# EAGLE design schema_v4_4 (EAGLE 6.5.0)
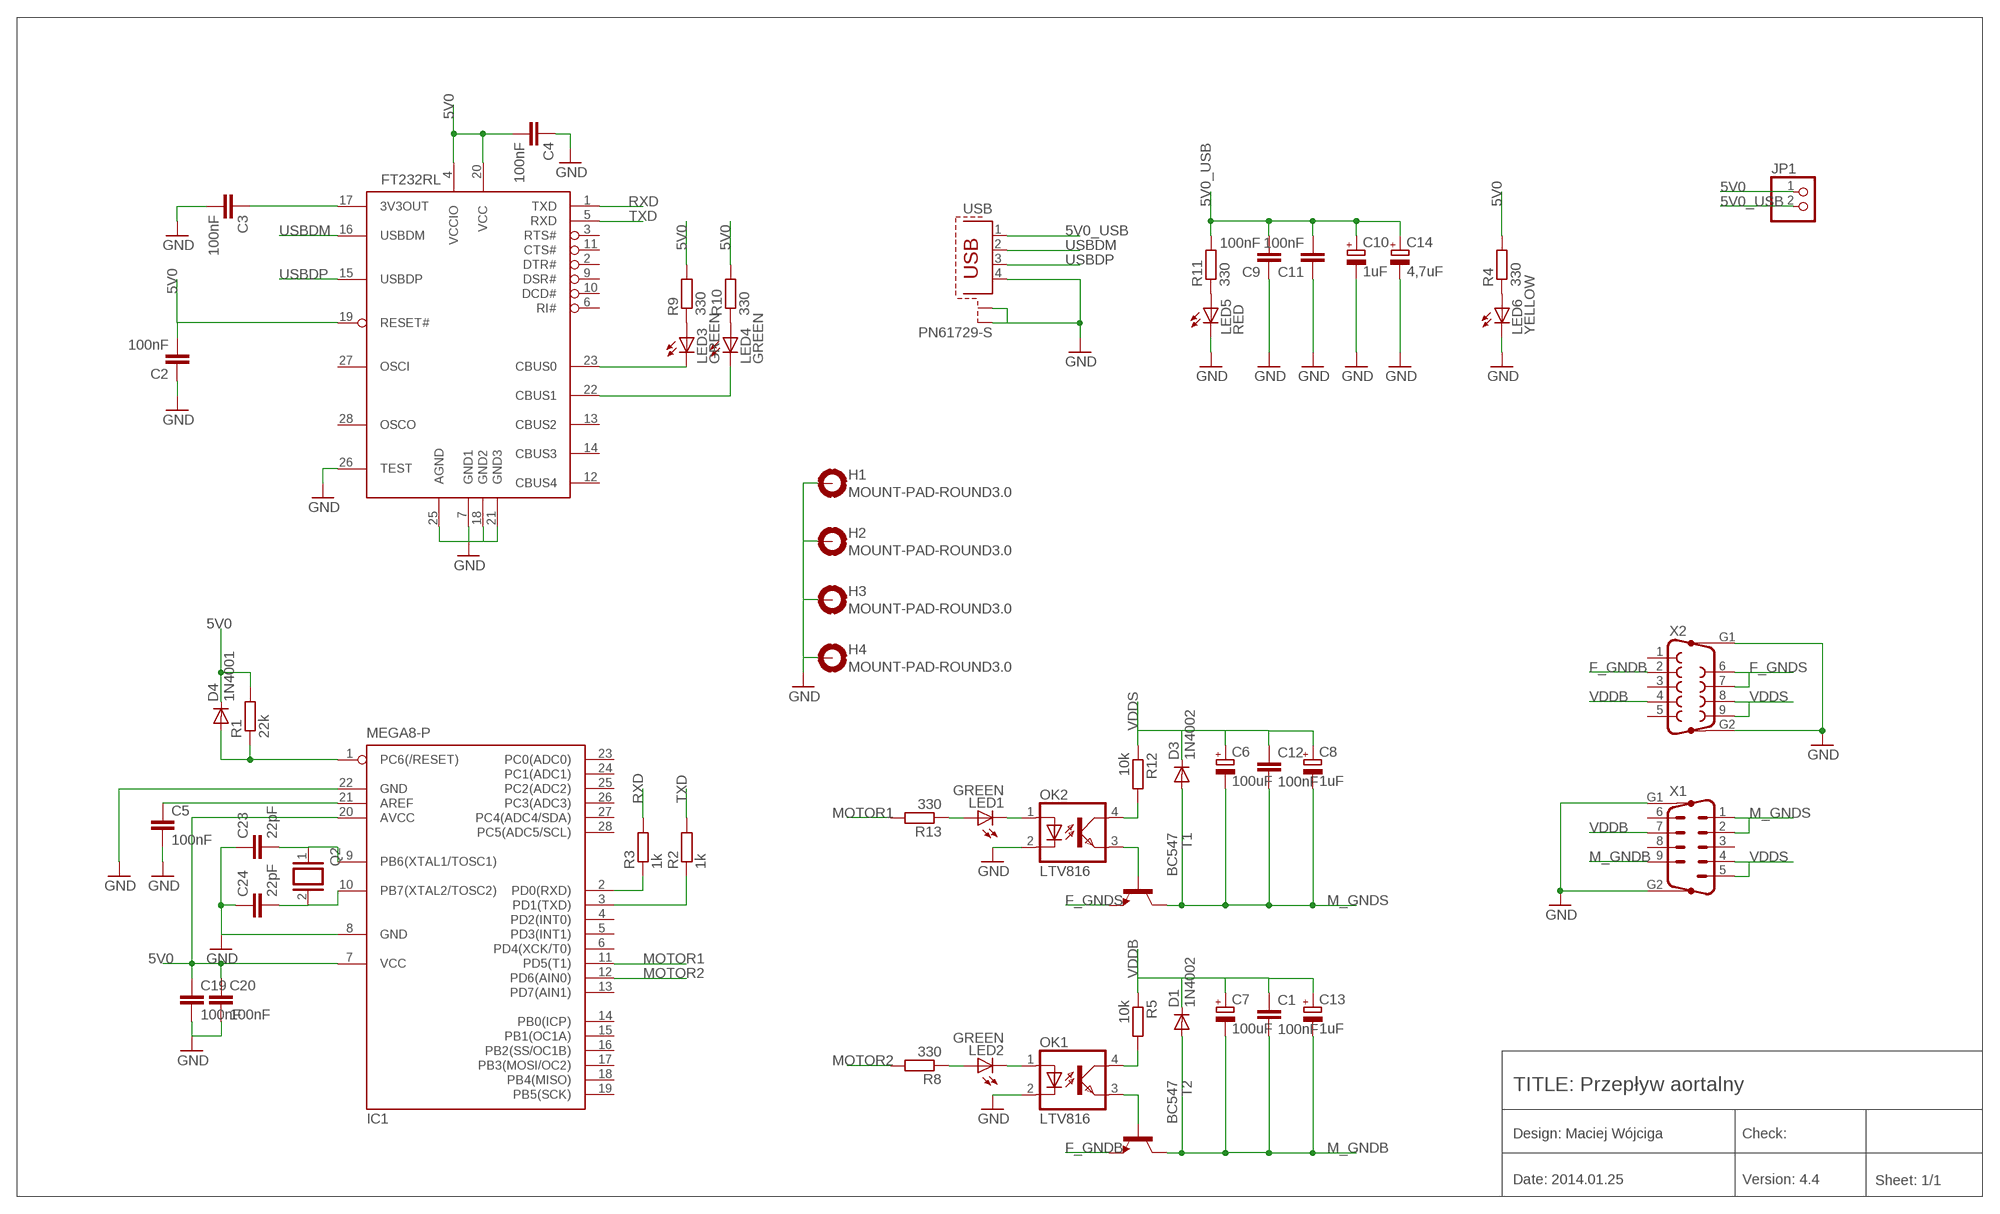
[diagram p0: schematic, sheet 1]

## Parts
C1  100nF  C-EU025-025X050  [C025-025X050]
C2  100nF  C-EU025-025X050  [C025-025X050]
C3  100nF  C-EU025-025X050  [C025-025X050]
C4  100nF  C-EU025-025X050  [C025-025X050]
C5  100nF  C-EU025-025X050  [C025-025X050]
C6  100uF  CPOL-EUE5-13  [E5-13]
C7  100uF  CPOL-EUE5-13  [E5-13]
C8  1uF  CPOL-EUE2-4  [E2-4]
C9  100nF  C-EU025-025X050  [C025-025X050]
C10  1uF  CPOL-EUE2.5-5  [E2,5-5]
C11  100nF  C-EU025-025X050  [C025-025X050]
C12  100nF  C-EU025-025X050  [C025-025X050]
C13  1uF  CPOL-EUE2-4  [E2-4]
C14  4,7uF  CPOL-EUE2.5-5  [E2,5-5]
C19  100nF  C-EU025-025X050  [C025-025X050]
C20  100nF  C-EU025-025X050  [C025-025X050]
C23  22pF  C-EU025-025X050  [C025-025X050]
C24  22pF  C-EU025-025X050  [C025-025X050]
D1  1N4002  1N4004  [DO41-10]
D3  1N4002  1N4004  [DO41-10]
D4  1N4001  1N4004  [DO41-10]
FT232RL  FT232RL  [SSOP28DB]
H1  MOUNT-PAD-ROUND3.0  [3,0-PAD]
H2  MOUNT-PAD-ROUND3.0  [3,0-PAD]
H3  MOUNT-PAD-ROUND3.0  [3,0-PAD]
H4  MOUNT-PAD-ROUND3.0  [3,0-PAD]
IC1  MEGA8-P  [DIL28-3]
JP1  PINHD-1X2  [1X02]
LED1  GREEN  LED3MM  [LED3MM]
LED2  GREEN  LED3MM  [LED3MM]
LED3  GREEN  LED3MM  [LED3MM]
LED4  GREEN  LED3MM  [LED3MM]
LED5  RED  LED3MM  [LED3MM]
LED6  YELLOW  LED3MM  [LED3MM]
OK1  LTV816  [DIL04]
OK2  LTV816  [DIL04]
Q2  XTAL/S  [QS]
R1  22k  R-EU_0207/10  [0207/10]
R2  1k  R-EU_0207/10  [0207/10]
R3  1k  R-EU_0207/10  [0207/10]
R4  330  R-EU_0207/10  [0207/10]
R5  10k  R-EU_0207/10  [0207/10]
R8  330  R-EU_0207/10  [0207/10]
R9  330  R-EU_0207/10  [0207/10]
R10  330  R-EU_0207/10  [0207/10]
R11  330  R-EU_0207/10  [0207/10]
R12  10k  R-EU_0207/10  [0207/10]
R13  330  R-EU_0207/10  [0207/10]
T1  BC547  [TO92]
T2  BC547  [TO92]
USB  PN61729-S  [PN61729-S]
X1  M09HP  [M09HP]
X2  F09HP  [F09HP]

## Nets
5V0: C2.2 C4.2 C19.1 C20.1 D4.C FT232RL.4(VCCIO) FT232RL.19(RESET#) FT232RL.20(VCC) IC1.7(VCC) IC1.20(AVCC) JP1.1 R1.2 R4.2 R9.2 R10.2
5V0_USB: C9.2 C10.+ C11.2 C14.+ JP1.2 R11.2 USB.1
F_GNDB: T2.1(E) X2.2
F_GNDS: T1.1(E) X2.6 X2.7
GND: C2.1 C3.2 C4.1 C5.2 C9.1 C10.- C11.1 C14.- C19.2 C20.2 C23.1 C24.1 FT232RL.7(GND1) FT232RL.18(GND2) FT232RL.21(GND3) FT232RL.25(AGND) FT232RL.26(TEST) H1.B3,0(MOUNT) H2.B3,0(MOUNT) H3.B3,0(MOUNT) H4.B3,0(MOUNT) IC1.8(GND) IC1.22(GND) LED5.K(C) LED6.K(C) OK1.2(C) OK2.2(C) USB.4 USB.S1 USB.S2 X1.G1 X1.G2 X2.G1 X2.G2
M_GNDB: C1.2 C7.- C13.- D1.A T2.3(C) X1.9
M_GNDS: C6.- C8.- C12.2 D3.A T1.3(C) X1.1 X1.2
MOTOR1: IC1.11(PD5(T1)) R13.2
MOTOR2: IC1.12(PD6(AIN0)) R8.2
N$1: IC1.3(PD1(TXD)) R2.1
N$2: IC1.2(PD0(RXD)) R3.1
N$3: LED6.A R4.1
N$4: LED1.A R13.1
N$5: LED1.K(C) OK2.1(A)
N$6: LED2.A R8.1
N$7: OK2.4(COL) R12.2
N$8: LED3.A R9.1
N$9: LED4.A R10.1
N$10: LED5.A R11.1
N$11: OK1.4(COL) R5.2
N$12: LED2.K(C) OK1.1(A)
N$13: OK1.3(EMIT) T2.2(B)
N$15: OK2.3(EMIT) T1.2(B)
N$26: C5.1 IC1.21(AREF)
N$29: C23.2 IC1.9(PB6(XTAL1/TOSC1)) Q2.1
N$35: C24.2 IC1.10(PB7(XTAL2/TOSC2)) Q2.2
N$41: FT232RL.23(CBUS0) LED3.K(C)
N$42: FT232RL.22(CBUS1) LED4.K(C)
N$96: C3.1 FT232RL.17(3V3OUT)
RESET: D4.A IC1.1(PC6(/RESET)) R1.1
RXD: FT232RL.1(TXD) R3.2
TXD: FT232RL.5(RXD) R2.2
USBDM: FT232RL.16(USBDM) USB.2
USBDP: FT232RL.15(USBDP) USB.3
VDDB: C1.1 C7.+ C13.+ D1.C R5.1 X1.7 X2.4
VDDS: C6.+ C8.+ C12.1 D3.C R12.1 X1.4 X1.5 X2.8 X2.9
Unconnected: FT232RL.2(DTR#) FT232RL.3(RTS#) FT232RL.6(RI#) FT232RL.9(DSR#) FT232RL.10(DCD#) FT232RL.11(CTS#) FT232RL.12(CBUS4) FT232RL.13(CBUS2) FT232RL.14(CBUS3) FT232RL.27(OSCI) FT232RL.28(OSCO) IC1.4(PD2(INT0)) IC1.5(PD3(INT1)) IC1.6(PD4(XCK/T0)) IC1.13(PD7(AIN1)) IC1.14(PB0(ICP)) IC1.15(PB1(OC1A)) IC1.16(PB2(SS/OC1B)) IC1.17(PB3(MOSI/OC2)) IC1.18(PB4(MISO)) IC1.19(PB5(SCK)) IC1.23(PC0(ADC0)) IC1.24(PC1(ADC1)) IC1.25(PC2(ADC2)) IC1.26(PC3(ADC3)) IC1.27(PC4(ADC4/SDA)) IC1.28(PC5(ADC5/SCL)) X1.3 X1.6 X1.8 X2.1 X2.3 X2.5

## Notes on the sheet
- TITLE: Przepływ aortalny
- Design: Maciej Wójciga | Check:
- Date: 2014.01.25 | Version: 4.4 | Sheet: 1/1

## Library data of the parts
C1-C5 C9 C11 C12 C19 C20 C23 C24 = rcl:C-EU: CAPACITOR, European symbol
C6-C8 C10 C13 C14 = rcl:CPOL-EU: POLARIZED CAPACITOR, European symbol
D1 D3 D4 = diode:1N4004: DIODE general purpose rectifier, 1 A
FT232RL = ftdichip-5:FT232RL: USB UART 4th Generation USB UART (USB <-> Serial) Controller
H1-H4 = holes:MOUNT-PAD-ROUND: MOUNTING PAD, round
IC1 = atmel:MEGA8-P: MICROCONTROLLER 8 Kbytes FLASH, 1 kbytes SRAM, 512 bytes EEPROM, USART, 4-channel 10 bit ADC, 2-channel 8 bit ADC Pin compatible with Atmega48, ATMega88, ATMega168 Source: avr.lbr; OC_FARNELL: unknown; OC_NEWARK: unknown
JP1 = pinhead:PINHD-1X2: PIN HEADER
LED1-LED6 = led:LED: LED OSRAM: - CHIPLED LG R971, LG N971, LY N971, LG Q971, LY Q971, LO R971, LY R971 LH N974, LH R974 LS Q976, LO Q976, LY Q976 LO Q996 - Hyper CHIPLED LW Q18S LB Q993, LB Q99A, LB R99A - SideLED LS A670, LO A670, LY A670, LG A670, LP A670 LB A673, LV A673, LT A673, LW A673 LH A674 LY A675 LS A676, LA A676, LO A676, LY A676, LW A676 LS A679, LY A679, LG A679 - Hyper Micro SIDELED® LS Y876, LA Y876, LO Y876, LY Y876 LT Y87S - SmartLED LW L88C, LW L88S LB L89C, LB L89S, LG L890 LS L89K, LO L89K, LY L89K LS L896, LA L896, LO L896, LY L896 - TOPLED LS T670, LO T670, LY T670, LG T670, LP T670 LSG T670, LSP T670, LSY T670, LOP T670, LYG T670 LG T671, LOG T671, LSG T671 LB T673, LV T673, LT T673, LW T673 LH T674 LS T676, LA T676, LO T676, LY T676, LB T676, LH T676, LSB T676, LW T676 LB T67C, LV T67C, LT T67C, LS T67K, LO T67K, LY T67K, LW E67C LS E67B, LA E67B, LO E67B, LY E67B, LB E67C, LV E67C, LT E67C LW T67C LS T679, LY T679, LG T679 LS T770, LO T770, LY T770, LG T770, LP T770 LB T773, LV T773, LT T773, LW T773 LH T774 LS E675, LA E675, LY E675, LS T675 LS T776, LA T776, LO T776, LY T776, LB T776 LHGB T686 LT T68C, LB T68C - Hyper Mini TOPLED® LB M676 - Mini TOPLED Santana® LG M470 LS M47K, LO M47K, LY M47K Source: http://www.osram.convergy.de LUXEON: - LUMILED® LXK2-PW12-R00, LXK2-PW12-S00, LXK2-PW14-U00, LXK2-PW14-V00 LXK2-PM12-R00, LXK2-PM12-S00, LXK2-PM14-U00 LXK2-PE12-Q00, LXK2-PE12-R00, LXK2-PE12-S00, LXK2-PE14-T00, LXK2-PE14-U00 LXK2-PB12-K00, LXK2-PB12-L00, LXK2-PB12-M00, LXK2-PB14-N00, LXK2-PB14-P00, LXK2-PB14-Q00 LXK2-PR12-L00, LXK2-PR12-M00, LXK2-PR14-Q00, LXK2-PR14-R00 LXK2-PD12-Q00, LXK2-PD12-R00, LXK2-PD12-S00 LXK2-PH12-R00, LXK2-PH12-S00 LXK2-PL12-P00, LXK2-PL12-Q00, LXK2-PL12-R00 Source: www.luxeon.com KINGBRIGHT: KA-3528ASYC Source: www.kingbright.com
OK1 OK2 = optocoupler:LTV816: OPTO COUPLER Source: LITEON, LTV816.pdf; OC_FARNELL: unknown; OC_NEWARK: unknown
Q2 = special:XTAL/S: CRYSTAL
R1-R5 R8-R13 = rcl:R-EU_: RESISTOR, European symbol
T1 T2 = transistor:BC547: NPN TRANSISTOR
USB = con-berg:PN61729-S: BERG USB connector; OC_FARNELL: unknown; OC_NEWARK: unknown
X1 = con-subd:M09HP: SUB-D; OC_FARNELL: unknown; OC_NEWARK: unknown
X2 = con-subd:F09HP: SUB-D; OC_FARNELL: unknown; OC_NEWARK: unknown

## Net classes
0 default: width 0.203 mm

## Board
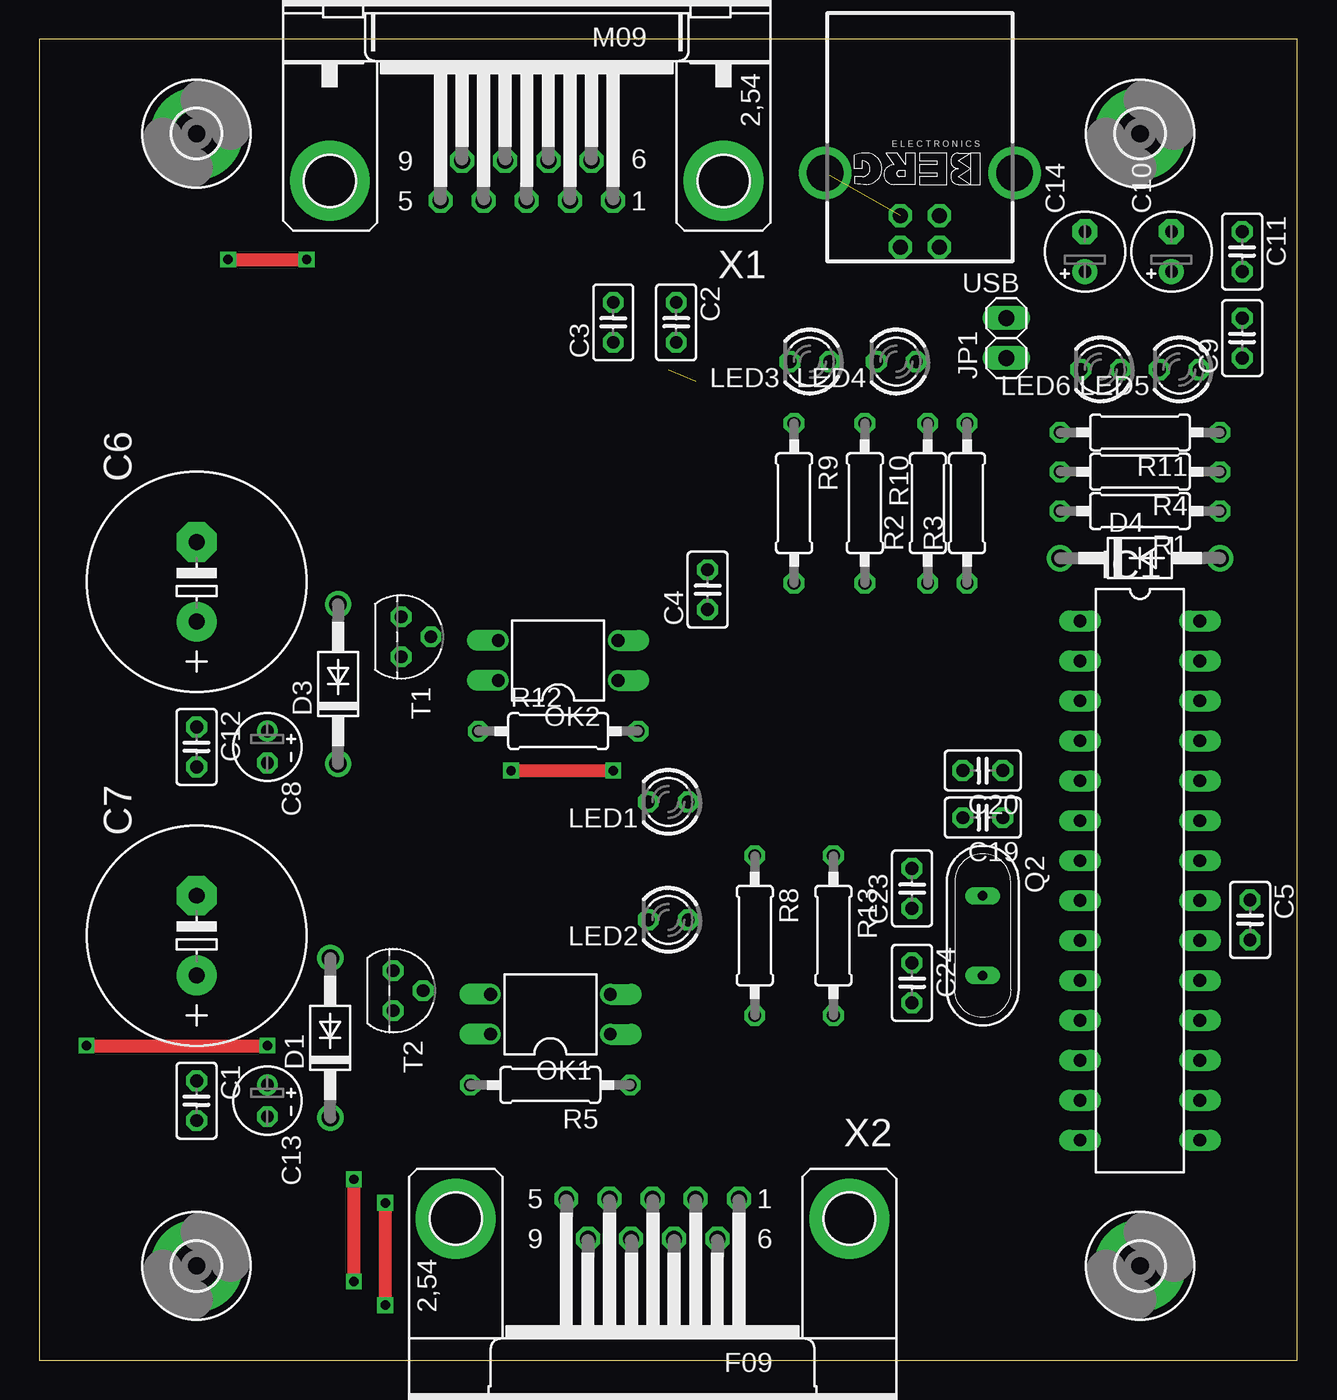
[diagram p1: board, top side]
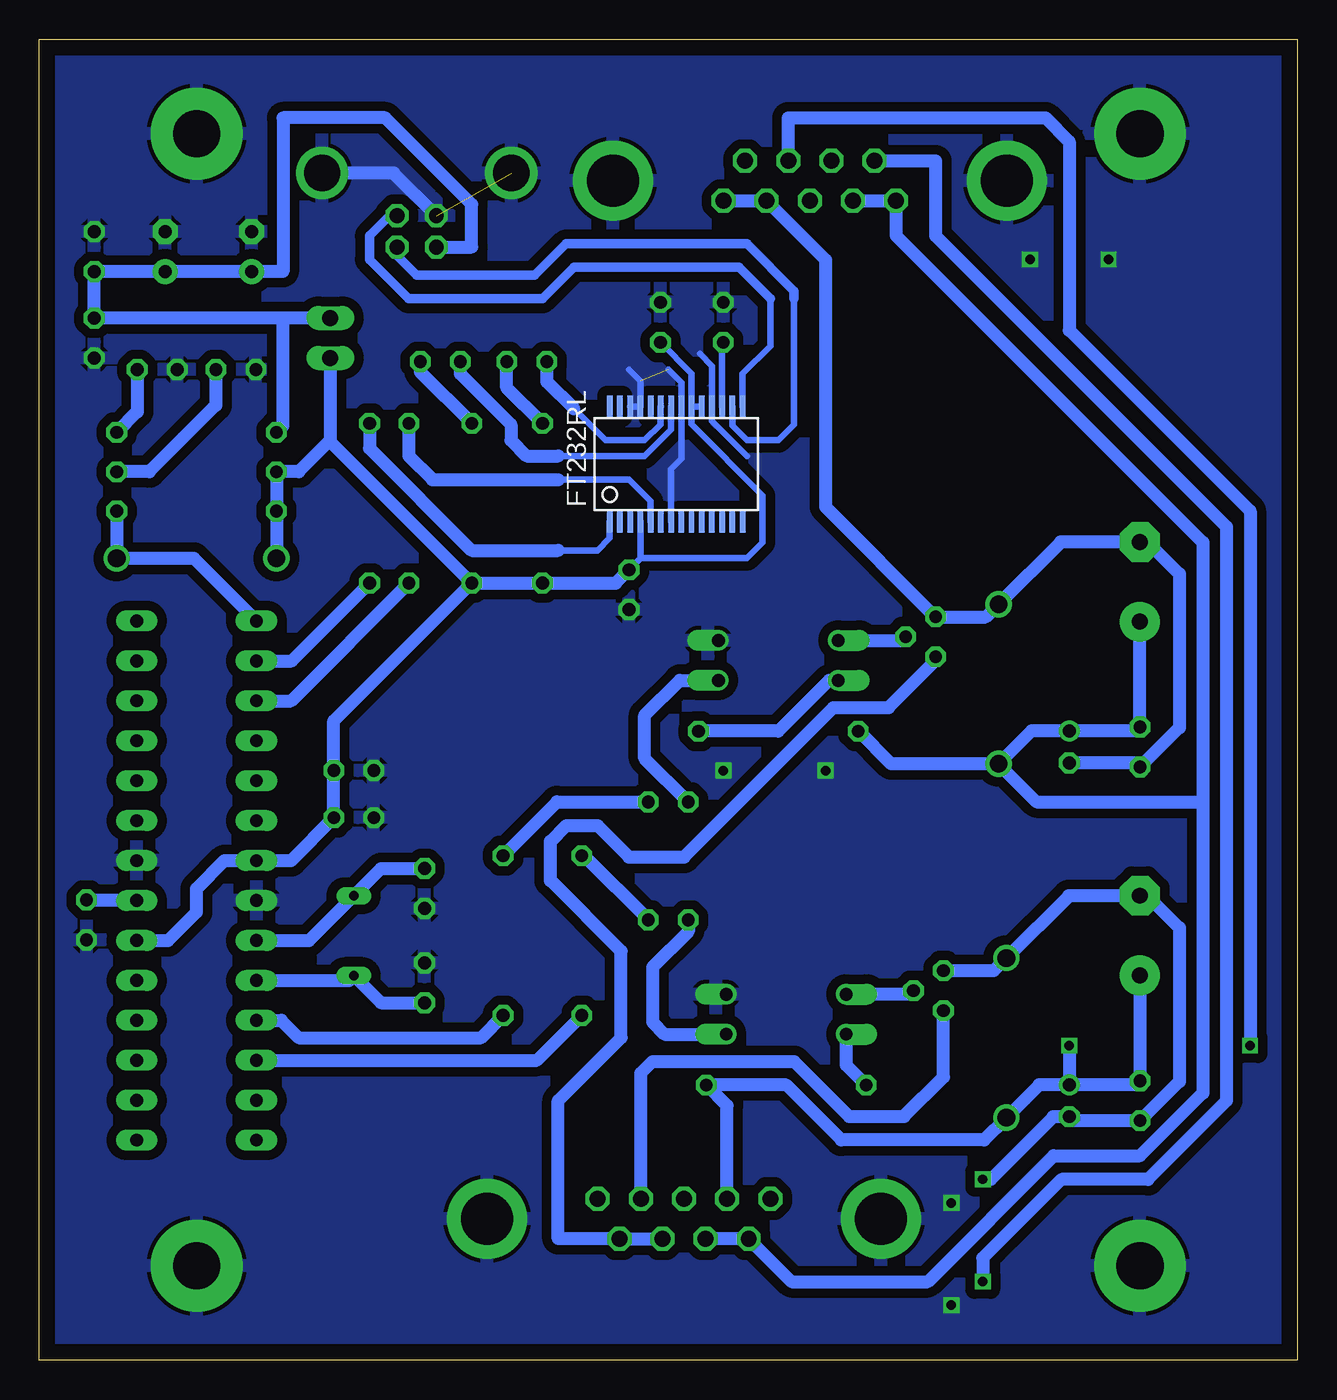
[diagram p2: board, bottom side, seen from below]

Size 80 x 84 mm. Coordinates in mm from the lower left corner, seen from the top.
Outline: 0,0 80,0 80,84 0,84 0,0
Copper layers (1*16): Top 0.035mm / dielectric 1.5mm / Bottom 0.035mm
Design rules "default": minimum track width 10mil, minimum drill 24mil, track to track 8mil, track to pad 8mil, pad to pad 8mil, via to via 8mil, smd to smd 8mil, copper to edge 40mil, drill to drill 8mil, minimum pad ring 10mil, minimum via ring 8mil, stop-mask expansion 4mil, vias tented up to drill 0mil, thermal gap 10mil

### Footprints (pad centres in the part's own frame; a part is rotated, then mirrored left to right if it is on the bottom)
C025-025X050 = drill 0.813 octagon: 1 -1.27,0; 2 1.27,0
E5-13 = drill 1.016 pad 2.54: + -2.54,0 | drill 1.016 pad 2.54 octagon: - 2.54,0
E2-4 = drill 0.813 pad 1.27: + -1.016,0 | drill 0.813 pad 1.27 octagon: - 1.016,0
E2,5-5 = drill 0.813 pad 1.6: + -1.27,0 | drill 0.813 pad 1.6 octagon: - 1.27,0
DO41-10 = drill 1.118: A 5.08,0; C -5.08,0
SSOP28DB = smd 0.348 x 1.397: 1 -4.225,-3.656; 2 -3.575,-3.656; 3 -2.925,-3.656; 4 -2.275,-3.656; 5 -1.625,-3.656; 6 -0.975,-3.656; 7 -0.325,-3.656; 8 0.325,-3.656; 9 0.975,-3.656; 10 1.625,-3.656; 11 2.275,-3.656; 12 2.925,-3.656; 13 3.575,-3.656; 14 4.225,-3.656; 15 4.225,3.656; 16 3.575,3.656; 17 2.925,3.656; 18 2.275,3.656; 19 1.625,3.656; 20 0.975,3.656; 21 0.325,3.656; 22 -0.325,3.656; 23 -0.975,3.656; 24 -1.625,3.656; 25 -2.275,3.656; 26 -2.925,3.656; 27 -3.575,3.656; 28 -4.225,3.656
3,0-PAD = drill 3 pad 5.842: B3,0 0,0
DIL28-3 = drill 0.813 long: 1 -16.51,-3.81; 2 -13.97,-3.81; 3 -11.43,-3.81; 4 -8.89,-3.81; 5 -6.35,-3.81; 6 -3.81,-3.81; 7 -1.27,-3.81; 8 1.27,-3.81; 9 3.81,-3.81; 10 6.35,-3.81; 11 8.89,-3.81; 12 11.43,-3.81; 13 13.97,-3.81; 14 16.51,-3.81; 15 16.51,3.81; 16 13.97,3.81; 17 11.43,3.81; 18 8.89,3.81; 19 6.35,3.81; 20 3.81,3.81; 21 1.27,3.81; 22 -1.27,3.81; 23 -3.81,3.81; 24 -6.35,3.81; 25 -8.89,3.81; 26 -11.43,3.81; 27 -13.97,3.81; 28 -16.51,3.81
1X02 = drill 1.016 long: 1 -1.27,0; 2 1.27,0
LED3MM = drill 0.813 octagon: A -1.27,0; K 1.27,0
DIL04 = drill 0.813 offset: 1 -1.27,-3.81; 2 1.27,-3.81; 3 1.27,3.81; 4 -1.27,3.81
QS = drill 0.61 long: 1 -2.54,0; 2 2.54,0
0207/10 = drill 0.813 octagon: 1 -5.08,0; 2 5.08,0
TO92 = drill 0.813 octagon: 1 1.27,0; 2 0,1.905; 3 -1.27,0
PN61729-S = drill 0.95 octagon: 1 1.25,4.71; 2 -1.25,4.71; 3 -1.25,2.71; 4 1.25,2.71 | drill 2.3 pad 2.9: S1 -6.02,0; S2 6.02,0
M09HP = drill 1.016 octagon: 1 -5.486,1.27; 2 -2.743,1.27; 3 0,1.27; 4 2.743,1.27; 5 5.486,1.27; 6 -4.115,-1.27; 7 -1.372,-1.27; 8 1.372,-1.27; 9 4.115,-1.27 | drill 3.302 pad 5.08: G1 -12.522,0; G2 12.522,0
F09HP = drill 1.016 octagon: 1 -5.486,-1.27; 2 -2.743,-1.27; 3 0,-1.27; 4 2.743,-1.27; 5 5.486,-1.27; 6 -4.115,1.27; 7 -1.372,1.27; 8 1.372,1.27; 9 4.115,1.27 | drill 3.302 pad 5.08: G1 -12.522,0; G2 12.522,0

### Placement (x,y rotation side)
C1  10,16.5 270 top
C2  40.5,66 270 top
C3  36.5,66 90 top
C4  42.5,49 90 top
C5  77,28 270 top
C6  10,49.5 90 top
C7  10,27 90 top
C8  14.5,39 270 top
C9  76.5,65 90 top
C10  72,70.5 90 top
C11  76.5,70.5 270 top
C12  10,39 270 top
C13  14.5,16.5 270 top
C14  66.5,70.5 90 top
C19  60,34.5 180 top
C20  60,37.5 180 top
C23  55.5,30 90 top
C24  55.5,24 270 top
D1  18.5,20.5 90 top
D3  19,43 90 top
D4  70,51 0 top
FT232RL  39.5,57 0 bottom
H1  10,78 0 top
H2  70,78 0 top
H3  70,6 0 top
H4  10,6 0 top
IC1  70,30.5 270 top
JP1  61.5,65 90 top
LED1  40,35.5 180 top
LED2  40,28 180 top
LED3  49,63.5 180 top
LED4  54.5,63.5 180 top
LED5  72.5,63 180 top
LED6  67.5,63 180 top
OK1  32.5,22 90 top
OK2  33,44.5 90 top
Q2  60,27 270 top
R1  70,54 180 top
R2  56.5,54.5 90 top
R3  59,54.5 90 top
R4  70,56.5 180 top
R5  32.5,17.5 180 top
R8  45.5,27 270 top
R9  48,54.5 270 top
R10  52.5,54.5 270 top
R11  70,59 180 top
R12  33,40 0 top
R13  50.5,27 270 top
T1  23,46 270 top
T2  22.5,23.5 270 top
USB  56,75.5 180 top
X1  31,75 180 top
X2  39,9 180 top

### Tracks (layer width: path | path; a pad name or v marks a point on that pad's centre or on a via)
5V0
  Bottom 0.406: FT232RL.4 41.77,50.99 C4.2 41.77,51 35,51 34,52 34,55 38.52,59.52 FT232RL.20 | FT232RL.20 FT232RL.19 | C2.2 38.52,62.76 FT232RL.20
  Bottom 0.813: JP1.1 61.5,58.5 | 61.5,58.5 63.5,56.5 R4.2 R1.2 D4.C | IC1.20 71.81,26.69 70,28.5 70,30 68.23,31.77 IC1.7 64,31.77 C19.1 C20.1 61.27,40.65 R10.2 | R10.2 61.5,58.42 61.5,58.5 | R10.2 R9.2 43.35,49.42 C4.2
5V0_USB
  Bottom 0.813: JP1.2 64.5,66.27 | 64.5,66.27 C9.2 C11.2 C10.+ C14.+ 64.5,69.23 64.5,79 58,79 52.5,73.5 52.5,70.79 USB.1 | R11.2 64.5,59.42 64.5,66.27
F_GNDB
  Bottom 0.813: X2.2 41.74,18.26 41,19 32,19 28.5,15.5 25,15.5 22.5,18 T2.1
F_GNDS
  Bottom 0.813: T1.1 23,44.5 26,41.5 29.5,41.5 39,32 42.5,32 44.5,34 46.5,34 47.5,33 47.5,30.5 43,26 43,20.5 47,16.5 47,7.73 X2.6 X2.7
GND  (via drill 0.6)  (2 unrouted)
  Top 0.813: v12,70 v17,70 | v22,10 v22,3.5 | v30,37.5 v36.5,37.5
  Bottom 0.406: 38,64 37.23,63.23 FT232RL.18 37.23,59.73 35,57.5 | FT232RL.7 39.83,56.67 39.17,57.33 FT232RL.21 39.17,62.17 40,63 | FT232RL.26 FT232RL.25 41.77,62.27 42.5,63
  Bottom 0.813: USB.4 57.46,75.5 USB.S1
  pour Bottom (isolate 0.61): 0,84 80,84 80,0 0,0
M_GNDB  (via drill 0.6)
  Top 0.813: v20,11.5 v20,5
  Bottom 0.813: T2.3 19.31,24.77 D1.A 14.54,29.54 C7.- 9.54,29.54 7.5,27.5 7.5,17.73 C1.2 14.25,15.23 C13.- 15.52,15.48 19.5,11.5 v20,11.5 | X1.9 23,76.27 23,71.5 4.5,53 4.5,16.5 9.5,11.5 15,11.5 20,6.5 v20,5
M_GNDS
  Bottom 0.813: C8.- 10.25,37.98 C12.2 7.5,40.23 7.5,50 9.54,52.04 C6.- 15.04,52.04 D3.A 19.81,47.27 T1.3 30,54.27 30,69.99 X1.2 X1.1
MOTOR1
  Bottom 0.813: IC1.11 64.61,21.61 63.5,20.5 51.92,20.5 R13.2
MOTOR2
  Bottom 0.813: IC1.12 48.35,19.07 R8.2
N$1
  Bottom 0.813: IC1.3 63.99,41.93 R2.1
N$2
  Bottom 0.813: IC1.2 63.95,44.47 R3.1
N$3
  Bottom 0.813: LED6.A 68.77,60.73 73,56.5 R4.1
N$4
  Bottom 0.813: R13.1 47.08,35.5 LED1.A
N$5
  Bottom 0.813: LED1.K 41.5,38.27 41.5,41 39.27,43.23 OK2.1
N$6
  Bottom 0.813: R8.1 45.35,32.08 LED2.A
N$7
  Bottom 0.813: OK2.4 29.77,43.23 33,40 R12.2
N$8
  Bottom 0.813: R9.1 50.27,61.85 LED3.A
N$9
  Bottom 0.813: LED4.A 55.77,62.85 R10.1
N$10
  Bottom 0.813: LED5.A 73.77,60.31 R11.1
N$11
  Bottom 0.813: OK1.4 28.69,18.77 R5.2
N$12
  Bottom 0.813: LED2.K 38.73,27.27 41,25 41,21.5 40.23,20.73 OK1.1
N$13
  Bottom 0.813: T2.2 24.64,23.27 OK1.3
N$15
  Bottom 0.813: OK2.3 25.14,45.77 T1.2
N$26
  Bottom 0.813: IC1.21 76.96,29.23 C5.1
N$29
  Bottom 0.813: IC1.9 62.85,26.69 Q2.1 58.27,31.27 C23.2
N$35
  Bottom 0.813: IC1.10 60.31,24.15 Q2.2 58.27,22.73 C24.2
N$41
  Bottom 0.406: 46,60.5 44,58.5 41.5,58.5 40.5,59.5 40.5,60.63 FT232RL.23
  Bottom 0.813: LED3.K 47.73,62.23 46,60.5
N$42
  Bottom 0.406: 47,57.5 41.5,57.5 39.83,59.17 FT232RL.22
  Bottom 0.813: 47,57.5 49,57.5 50,58.5 50,59.5 53.23,62.73 LED4.K
N$96
  Bottom 0.406: C3.1 36.58,64.66 FT232RL.17
RESET
  Bottom 0.813: R1.1 D4.A 70.18,51 IC1.1
RXD
  Bottom 0.406: 47,51.5 44.5,51.5 43.73,52.27 FT232RL.1
  Bottom 0.813: R3.2 59,58 52.5,51.5 47,51.5
TXD
  Bottom 0.406: 47,56 42.5,56 41.12,54.62 FT232RL.5
  Bottom 0.813: R2.2 56.5,57.5 55,56 47,56
USBDM
  Bottom 0.406: FT232RL.16 35.92,59.42 35,58.5 33,58.5 32,59.5 32,67.5
  Bottom 0.61: 32,67.5 32,68 35,71 46.5,71 48.5,69 56,69 57.25,70.25 USB.2
USBDP
  Bottom 0.406: 33.5,67.5 33.5,64.5 35.27,62.73 FT232RL.15
  Bottom 0.61: USB.3 57.71,72.79 59,71.5 59,70 56.5,67.5 48,67.5 46,69.5 35.5,69.5 33.5,67.5
VDDB  (via drill 0.6)
  Top 0.813: v3,20 v14.5,20
  Bottom 0.813: C7.+ C1.1 10.25,17.52 C13.+ | C13.+ 16.4,17.52 D1.C 19.92,14 29,14 32.5,17.5 R5.1 36.26,16.18 X2.4 | X1.7 32.37,79 16,79 14.5,77.5 14.5,65.5 3,54 v3,20 | v14.5,20 C13.+
VDDS
  Bottom 0.813: D3.C 16.9,40.02 C8.+ 10.25,40.02 C12.1 C6.+ | D3.C 25.84,37.92 R12.1 | X2.8 X2.9 32.16,5 23.5,5 15.5,13 10,13 6,17 6,35.5 | D3.C 16.58,35.5 6,35.5 | X1.4 X1.5 25.51,71.51 6,52 6,35.5